# EAGLE design drone_fc (EAGLE 9.5.2)
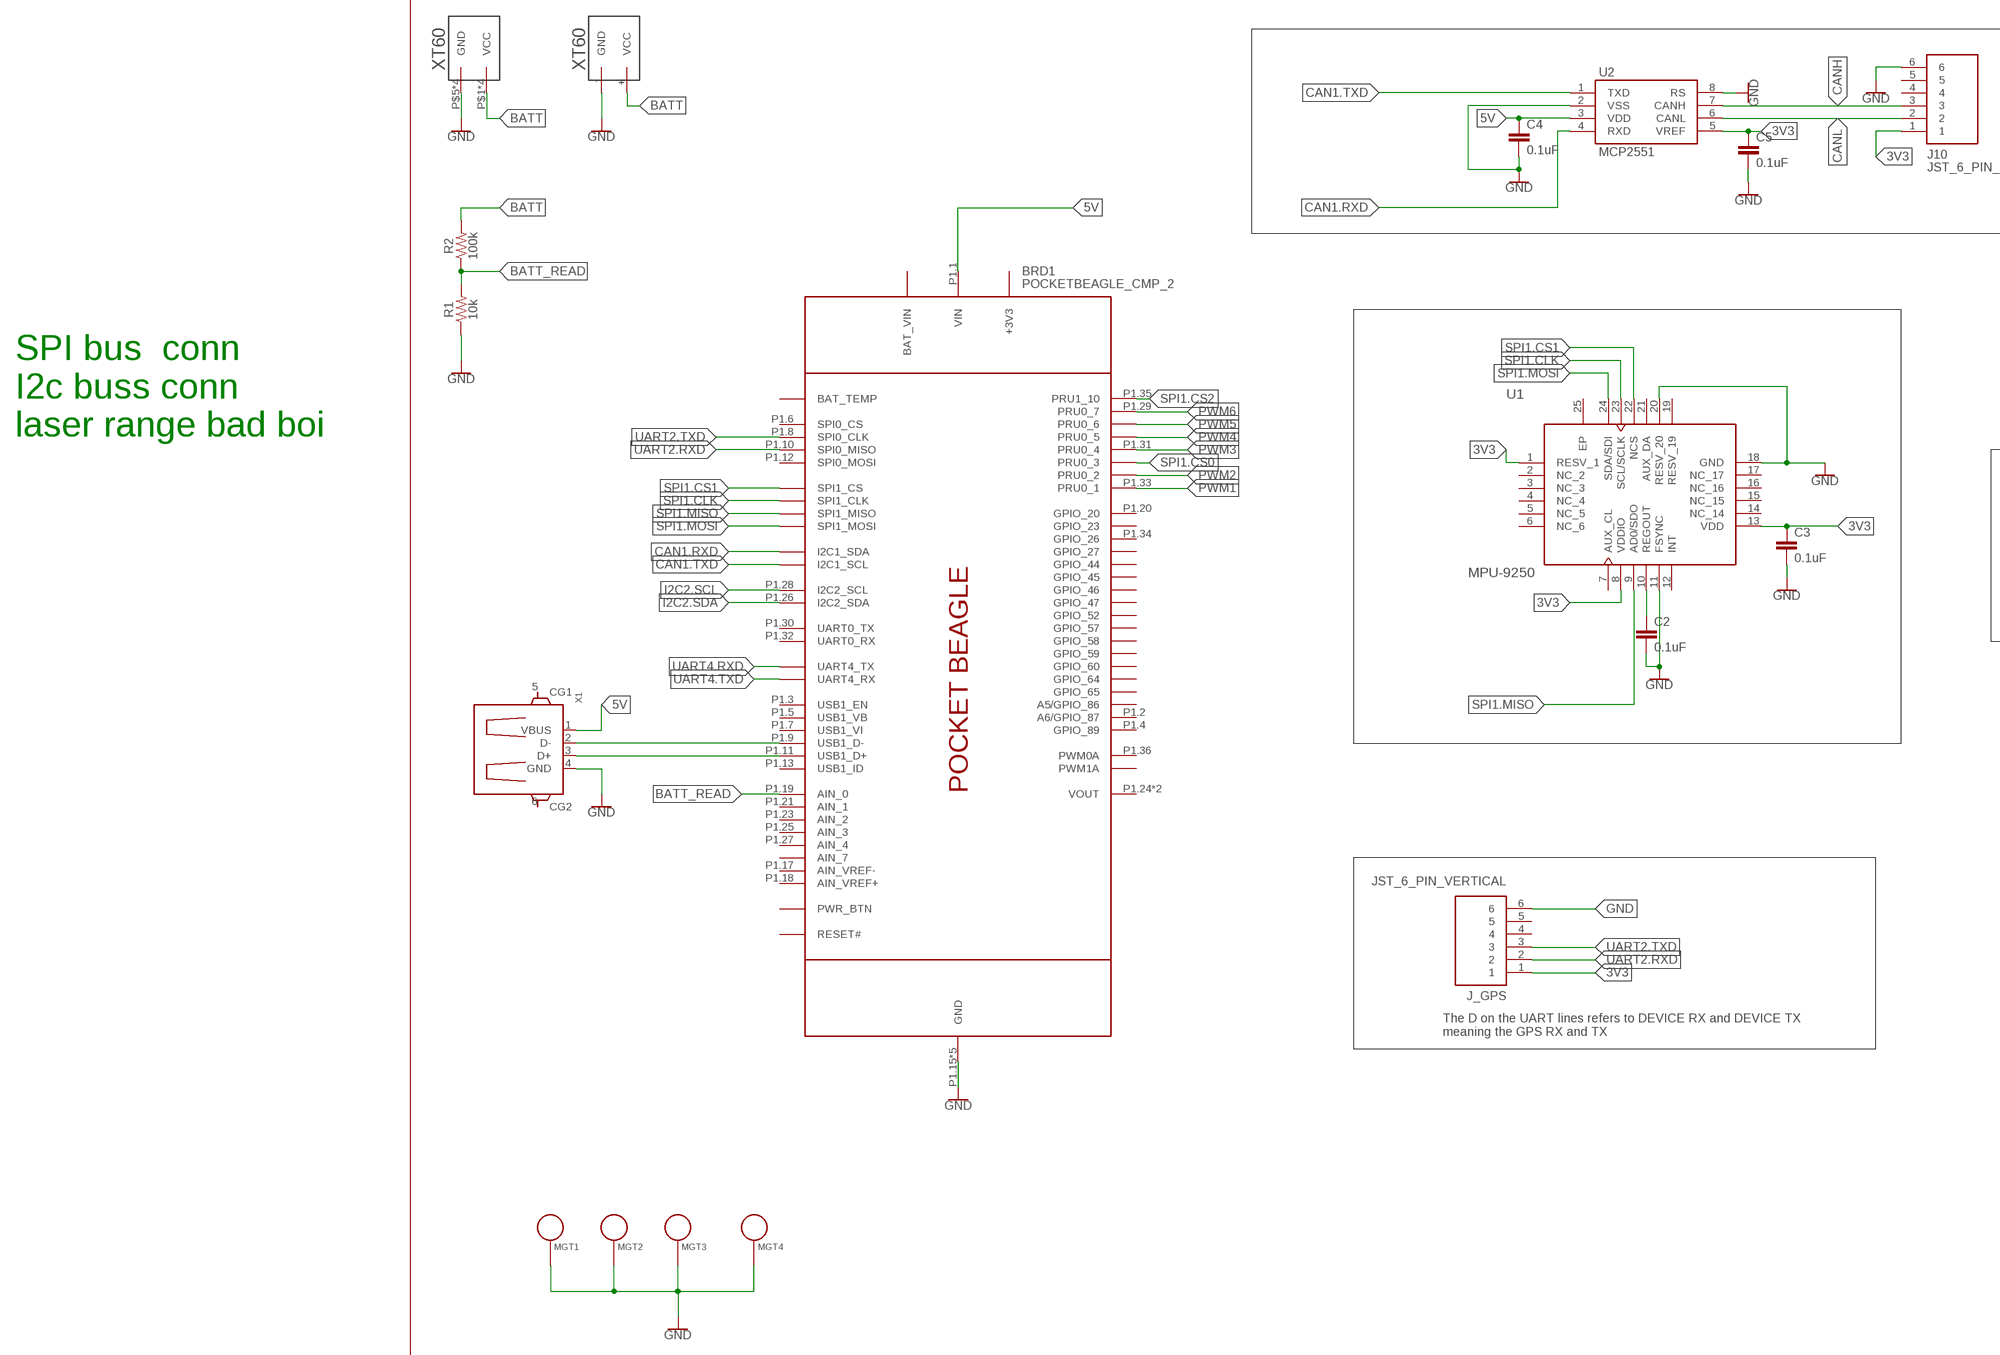
[diagram p0: schematic, sheet 1, part 1 of 2]
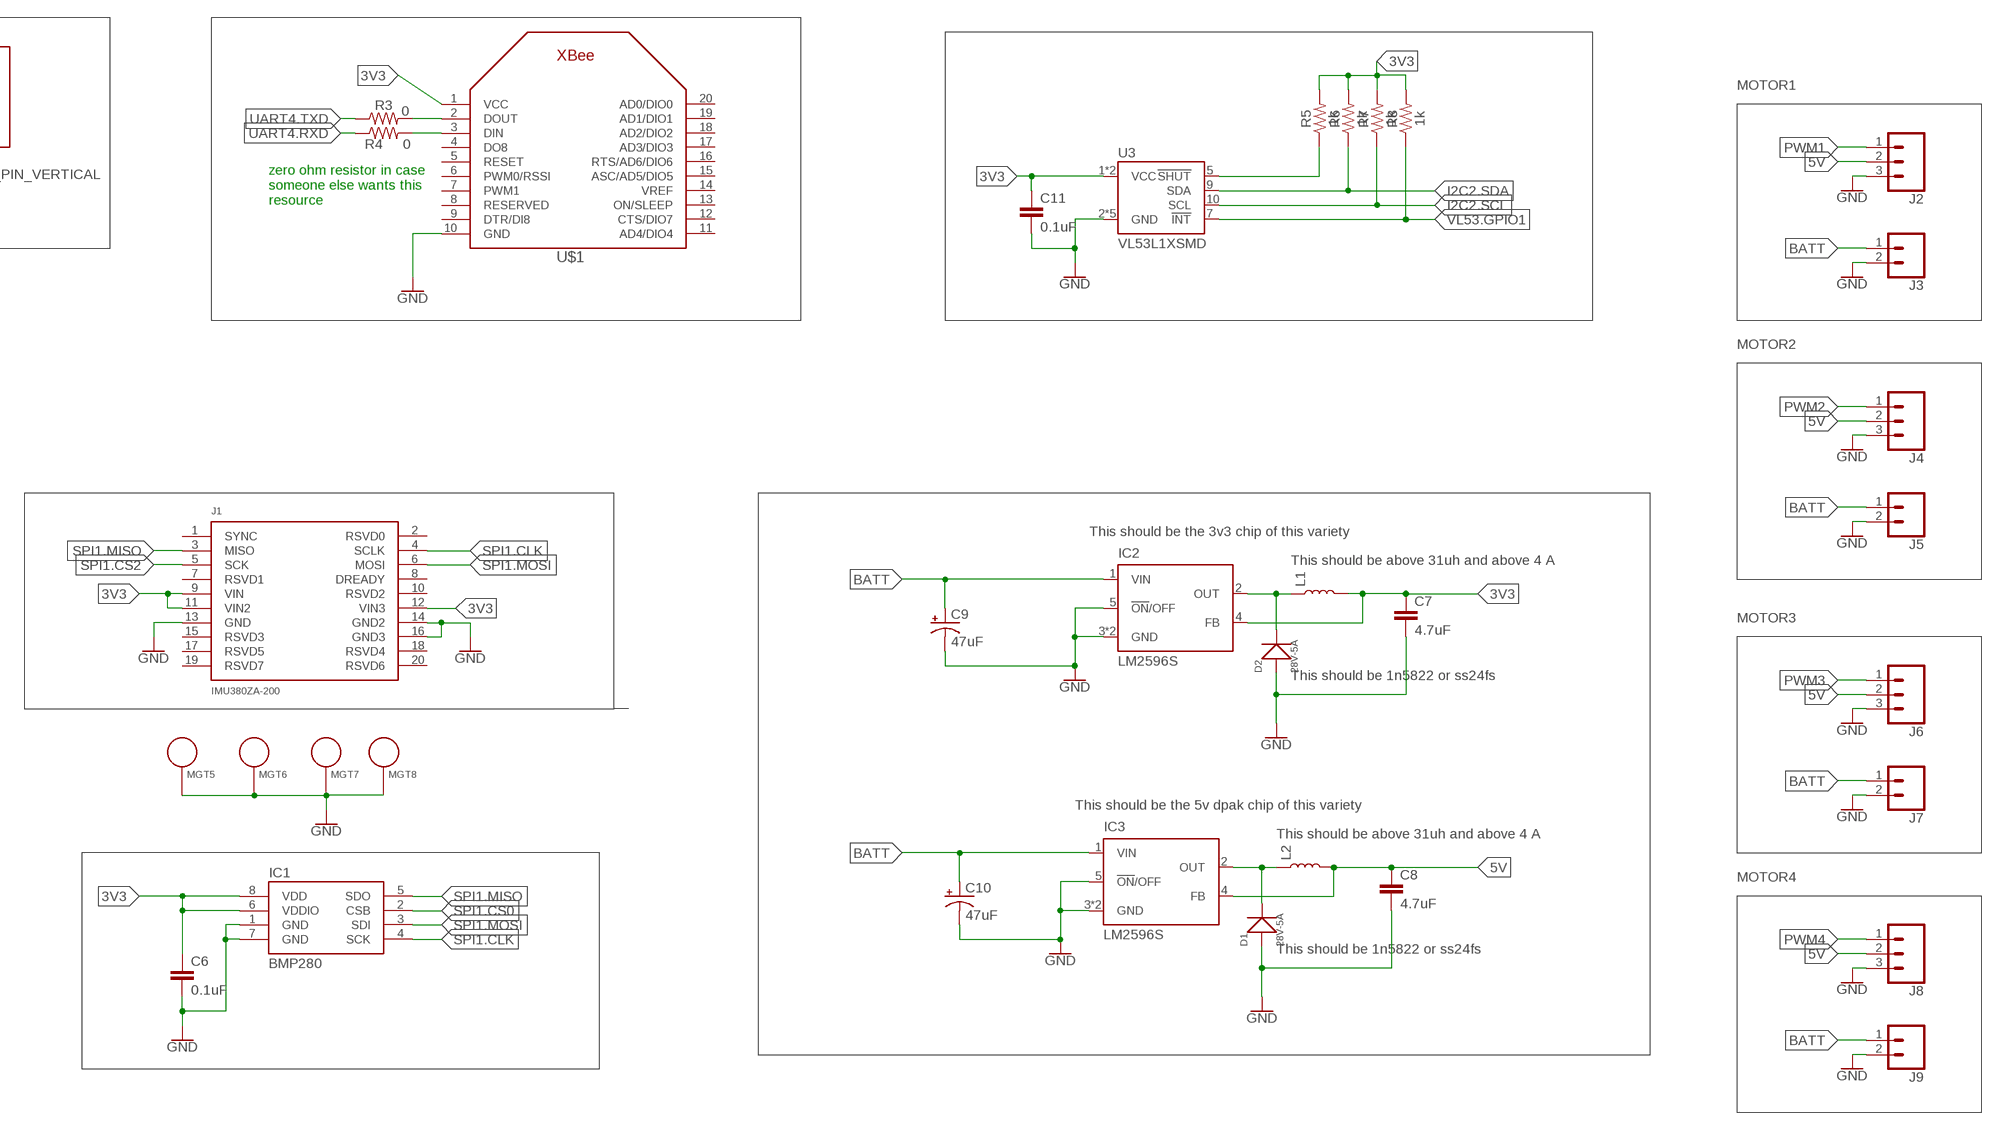
[diagram p1: schematic, sheet 1, part 2 of 2]

## Parts
BRD1  POCKETBEAGLE_CMP_2  [POCKETBEAGLE_CMP]
C2  0.1uF  0.1UF-0603-25V-5%  [0603]
C3  0.1uF  0.1UF-0603-25V-5%  [0603]
C4  0.1uF  0.1UF-0603-25V-5%  [0603]
C5  0.1uF  0.1UF-0603-25V-5%  [0603]
C6  0.1uF  0.1UF-0603-25V-5%  [0603]
C7  4.7uF  4.7UF-1206-16V-(+80/-20%)  [1206]
C8  4.7uF  4.7UF-1206-16V-(+80/-20%)  [1206]
C9  47uF  47UF-POLAR-PANASONIC_D-35V-20%  [PANASONIC_D]
C10  47uF  47UF-POLAR-PANASONIC_D-35V-20%  [PANASONIC_D]
C11  0.1uF  0.1UF-0603-25V-5%  [0603]
D1  28V-5A  SMD-DIODE-SCHOTTKY-28V-5A(DO-214AA)  [DO-214AA]
D2  28V-5A  SMD-DIODE-SCHOTTKY-28V-5A(DO-214AA)  [DO-214AA]
IC1  BMP280  [BMP280]
IC2  LM2596S  [TO263-5]
IC3  LM2596S  [TO263-5]
J1  IMU380ZA-200  [IMU380-CLM-110-02]
J2  CONN_03  [1X03]
J3  CONN_02PTH3  [1X02_LONGPADS]
J4  CONN_03  [1X03]
J5  CONN_02PTH3  [1X02_LONGPADS]
J6  CONN_03  [1X03]
J7  CONN_02PTH3  [1X02_LONGPADS]
J8  CONN_03  [1X03]
J9  CONN_02PTH3  [1X02_LONGPADS]
J10  JST_6_PIN_VERTICAL  [JST-6-SMD-VERT-1.0MM]
J_GPS  JST_6_PIN_VERTICAL  [JST-6-SMD-VERT-1.0MM]
L1  47µH/±30%/750mA  INDUCTOR-CR54-47UH  [CR54]
L2  47µH/±30%/750mA  INDUCTOR-CR54-47UH  [CR54]
MGT1  MOUNTING_HOLE  [BEAGLEBONEBLACK_MOUNTING_HOLE]
MGT2  MOUNTING_HOLE  [BEAGLEBONEBLACK_MOUNTING_HOLE]
MGT3  MOUNTING_HOLE  [BEAGLEBONEBLACK_MOUNTING_HOLE]
MGT4  MOUNTING_HOLE  [BEAGLEBONEBLACK_MOUNTING_HOLE]
MGT5  MOUNTING_HOLE  [BEAGLEBONEBLACK_MOUNTING_HOLE]
MGT6  MOUNTING_HOLE  [BEAGLEBONEBLACK_MOUNTING_HOLE]
MGT7  MOUNTING_HOLE  [BEAGLEBONEBLACK_MOUNTING_HOLE]
MGT8  MOUNTING_HOLE  [BEAGLEBONEBLACK_MOUNTING_HOLE]
R1  10k  10KOHM-0603-1/10W-1%  [0603]
R2  100k  100KOHM-0603-1/10W-1%  [0603]
R3  0  RESISTOR0603  [0603]
R4  0  RESISTOR0603  [0603]
R5  1k  1KOHM-0603-1/10W-1%  [0603]
R6  1k  1KOHM-0603-1/10W-1%  [0603]
R7  1k  1KOHM-0603-1/10W-1%  [0603]
R8  1k  1KOHM-0603-1/10W-1%  [0603]
U1  MPU-9250  [24-QFN]
U2  MCP2551  [SO08]
U3  VL53L1XSMD  [VL53L1X]
U$1  XBEE  [XBEE]
U$2  XT60_RA  [XT60_RA]
U$3  XT60  [XT60]
X1  GHI2_USB_HOST_W/CHASSIS_GND  [GHI2_USB_HOST_HORIZONTAL_W/CHASSIS_GND]

## Nets
3V3: C3.1 C5.1 C6.1 C7.1 C11.1 IC1.6(VDDIO) IC1.8(VDD) IC2.4(FB) J1.9(VIN) J1.11(VIN2) J1.12(VIN3) J10.1 J_GPS.1 L1.P$2 R5.2 R6.2 R7.2 R8.2 U1.1(RESV_1) U1.8(VDDIO) U1.13(VDD) U2.5(VREF) U3.1(VCC) U3.11(VCC) U$1.1(VCC)
5V: BRD1.P1.1(VIN) C4.1 C8.1 IC3.4(FB) J2.2 J4.2 J6.2 J8.2 L2.P$2 U2.3(VDD) X1.1(VBUS)
BATT: C9.+ C10.+ IC2.1(VIN) IC3.1(VIN) J3.1 J5.1 J7.1 J9.1 R2.2 U$2.P$1(VCC) U$2.P$2(VCC) U$2.P$3(VCC) U$2.P$4(VCC) U$3.+(VCC)
BATT_READ: BRD1.P1.19(AIN_0) R1.2 R2.1
CAN1.RXD: BRD1.P2.11(I2C1_SDA) U2.4(RXD)
CAN1.TXD: BRD1.P2.9(I2C1_SCL) U2.1(TXD)
CANH: J10.3 U2.7(CANH)
CANL: J10.2 U2.6(CANL)
GND: BRD1.P1.15(GND) BRD1.P1.16(GND) BRD1.P1.22(GND) BRD1.P2.15(GND) BRD1.P2.21(GND) C2.2 C3.2 C4.2 C5.2 C6.2 C7.2 C8.2 C9.- C10.- C11.2 D1.+ D2.+ IC1.1(GND) IC1.7(GND) IC2.3(GND) IC2.5(!ON!/OFF) IC2.6(GND) IC3.3(GND) IC3.5(!ON!/OFF) IC3.6(GND) J1.13(GND) J1.14(GND2) J1.16(GND3) J2.3 J3.2 J4.3 J5.2 J6.3 J7.2 J8.3 J9.2 J10.6 J_GPS.6 MGT1.P$1 MGT2.P$1 MGT3.P$1 MGT4.P$1 MGT5.P$1 MGT6.P$1 MGT7.P$1 MGT8.P$1 R1.1 U1.11(FSYNC) U1.18(GND) U1.20(RESV_20) U2.2(VSS) U2.8(RS) U3.2(GND) U3.3(GND) U3.4(GND) U3.6(GND) U3.12(GND) U$1.10(GND) U$2.P$5(GND) U$2.P$6(GND) U$2.P$7(GND) U$2.P$8(GND) U$3.-(GND) X1.4(GND)
I2C2.SCL: BRD1.P1.28(I2C2_SCL) R7.1 U3.10(SCL)
I2C2.SDA: BRD1.P1.26(I2C2_SDA) R6.1 U3.9(SDA)
I2C2.SHUT: R5.1 U3.5(!SHUT)
N$2: C2.1 U1.10(REGOUT)
N$3: BRD1.P1.11(USB1_D+) X1.3(D+)
N$4: BRD1.P1.9(USB1_D-) X1.2(D-)
N$6: D2.- IC2.2(OUT) L1.P$1
N$8: D1.- IC3.2(OUT) L2.P$1
N$10: R3.2 U$1.2(DOUT)
N$11: R4.2 U$1.3(DIN)
PWM1: BRD1.P1.33(PRU0_1) J2.1
PWM2: BRD1.P2.32(PRU0_2) J4.1
PWM3: BRD1.P1.31(PRU0_4) J6.1
PWM4: BRD1.P2.34(PRU0_5) J8.1
PWM5: BRD1.P2.28(PRU0_6)
PWM6: BRD1.P1.29(PRU0_7)
SPI1.CLK: BRD1.P2.29(SPI1_CLK) IC1.4(SCK) J1.4(SCLK) U1.23(SCL/SCLK)
SPI1.CS0: BRD1.P2.30(PRU0_3) IC1.2(CSB)
SPI1.CS1: BRD1.P2.31(SPI1_CS) U1.22(NCS)
SPI1.CS2: BRD1.P1.35(PRU1_10) J1.5(SCK)
SPI1.MISO: BRD1.P2.27(SPI1_MISO) IC1.5(SDO) J1.3(MISO) U1.9(AD0/SDO)
SPI1.MOSI: BRD1.P2.25(SPI1_MOSI) IC1.3(SDI) J1.6(MOSI) U1.24(SDA/SDI)
UART2.RXD: BRD1.P1.10(SPI0_MISO) J_GPS.2
UART2.TXD: BRD1.P1.8(SPI0_CLK) J_GPS.3
UART4.RXD: BRD1.P2.7(UART4_TX) R4.1
UART4.TXD: BRD1.P2.5(UART4_RX) R3.1
VL53.GPIO1: R8.1 U3.7(!INT)
Unconnected: BRD1.P1.2(A6/GPIO_87) BRD1.P1.3(USB1_EN) BRD1.P1.4(GPIO_89) BRD1.P1.5(USB1_VB) BRD1.P1.6(SPI0_CS) BRD1.P1.7(USB1_VI) BRD1.P1.12(SPI0_MOSI) BRD1.P1.13(USB1_ID) BRD1.P1.14(+3V3) BRD1.P1.17(AIN_VREF-) BRD1.P1.18(AIN_VREF+) BRD1.P1.20(GPIO_20) BRD1.P1.21(AIN_1) BRD1.P1.23(AIN_2) BRD1.P1.24(VOUT) BRD1.P1.25(AIN_3) BRD1.P1.27(AIN_4) BRD1.P1.30(UART0_TX) BRD1.P1.32(UART0_RX) BRD1.P1.34(GPIO_26) BRD1.P1.36(PWM0A) BRD1.P2.1(PWM1A) BRD1.P2.2(GPIO_59) BRD1.P2.3(GPIO_23) BRD1.P2.4(GPIO_58) BRD1.P2.6(GPIO_57) BRD1.P2.8(GPIO_60) BRD1.P2.10(GPIO_52) BRD1.P2.12(PWR_BTN) BRD1.P2.13(VOUT) BRD1.P2.14(BAT_VIN) BRD1.P2.16(BAT_TEMP) BRD1.P2.17(GPIO_65) BRD1.P2.18(GPIO_47) BRD1.P2.19(GPIO_27) BRD1.P2.20(GPIO_64) BRD1.P2.22(GPIO_46) BRD1.P2.23(+3V3) BRD1.P2.24(GPIO_44) BRD1.P2.26(RESET#) BRD1.P2.33(GPIO_45) BRD1.P2.35(A5/GPIO_86) BRD1.P2.36(AIN_7) J1.1(SYNC) J1.2(RSVD0) J1.7(RSVD1) J1.8(DREADY) J1.10(RSVD2) J1.15(RSVD3) J1.17(RSVD5) J1.18(RSVD4) J1.19(RSVD7) J1.20(RSVD6) J10.4 J10.5 J_GPS.4 J_GPS.5 U1.2(NC_2) U1.3(NC_3) U1.4(NC_4) U1.5(NC_5) U1.6(NC_6) U1.7(AUX_CL) U1.12(INT) U1.14(NC_14) U1.15(NC_15) U1.16(NC_16) U1.17(NC_17) U1.19(RESV_19) U1.21(AUX_DA) U$1.4(DO8) U$1.5(RESET) U$1.6(PWM0/RSSI) U$1.7(PWM1) U$1.8(RESERVED) U$1.9(DTR/DI8) U$1.11(AD4/DIO4) U$1.12(CTS/DIO7) U$1.13(ON/SLEEP) U$1.14(VREF) U$1.15(ASC/AD5/DIO5) U$1.16(RTS/AD6/DIO6) U$1.17(AD3/DIO3) U$1.18(AD2/DIO2) U$1.19(AD1/DIO1) U$1.20(AD0/DIO0) X1.5(CG1) X1.6(CG2)

## Notes on the sheet
- MOTOR1
- zero ohm resistor in case
  someone else wants this
  resource
- MOTOR2
- SPI bus  conn
  I2c buss conn
  laser range bad boi
- This should be the 3v3 chip of this variety
- This should be above 31uh and above 4 A
- MOTOR3
- This should be 1n5822 or ss24fs
- This should be the 5v dpak chip of this variety
- This should be above 31uh and above 4 A
- MOTOR4
- This should be 1n5822 or ss24fs
- The D on the UART lines refers to DEVICE RX and DEVICE TX
  meaning the GPS RX and TX

## Power pins joined to a net without a drawn wire
EP: U1.25(EP)

## Library data of the parts
BRD1 = BeagleBone_pocket:POCKETBEAGLE_?_2: BeagleBoard.org PocketBeagle What is PocketBeagle? PocketBeagle is an ultra-tiny-yet-complete open-source USB-key-fob computer. PocketBeagle features an incredible low cost, slick design and simple usage, making PocketBeagle the ideal development board for beginners and professionals alike. Processor: Octavo Systems OSD3358 1GHz ARMÂ® Cortex-A8 512MB DDR3 RAM integrated Integrated power management 2Ã—32-bit 200-MHz programmable real-time units (PRUs) ARM Cortex-M3 Summary of Key Features Low cost Linux computer with tremendous expansibility Opportunity to learn many programming aspects from educators on-line Openness and flexibility tear-down limits on your imagination Summary of Technical Specifications Based on new Octavo Systems OSD3358-SM 21mm x 21mm system-in-package that includes 512MB DDR3 RAM, 1-GHz ARM Cortex-A8 CPU, 2x 200-MHz PRUs, ARM Cortex-M3, 3D accelerator, power/battery management and EEPROM 72 expansion pin headers with power and battery I/Os, high-speed USB, 8 analog inputs, 44 digital I/Os and numerous digital interface peripherals microUSB host/client and microSD connectors
C2-C6 C11 = SparkFun-Capacitors:0.1UF: 0.1µF ceramic capacitors A capacitor is a passive two-terminal electrical component used to store electrical energy temporarily in an electric field.; PROD_ID: CAP-08604
C7 C8 = SparkFun-Capacitors:4.7UF: 4.7µF ceramic capacitors A capacitor is a passive two-terminal electrical component used to store electrical energy temporarily in an electric field.; PROD_ID: CAP-10300
C9 C10 = SparkFun-Capacitors:47UF-POLAR: 47µF polarized capacitors A capacitor is a passive two-terminal electrical component used to store electrical energy temporarily in an electric field.; PROD_ID: CAP-08478
D1 D2 = Seeed-Diode:SMD-DIODE-SCHOTTKY-28V-5A(DO-214AA): 304020021; MPN: SS54B
IC1 = BeagleBone_Blue_R3:BMP280: BOSCH BMP280 Digital Pressure Sensor
IC2 IC3 = national-semiconductor_DRONEMODS:LM2596: SIMPLE SWITCHER® Power Converter 150 kHz 3A Step-Down Voltage Regulator Source: http://www.national.com/ds/LM/LM2596.pdf; MF: NATIONAL SEMICONDUCTOR; MPN: LM2596S-ADJ/NOPB; OC_FARNELL: 9494367; OC_NEWARK: 41K3842
J1 = mylib:IMU380ZA-200: LOW PROFILE 1MMX1MM DOUBLE ROW BODY. MANUFACTURER:SAMTEC.
J2 J4 J6 J8 = SparkFun-Connectors:CONN_03: Multi connection point. Often used as Generic Header-pin footprint for 0.1 inch spaced/style header connections On any of the 0.1 inch spaced packages, you can populate with these: Break Away Headers - Straight <https://www.sparkfun.com/products/116> (PRT-00116) Break Away Male Headers - Right Angle <https://www.sparkfun.com/products/553> (PRT-00553) Female Headers <https://www.sparkfun.com/products/115> (PRT-00115) Break Away Headers - Machine Pin <https://www.sparkfun.com/products/117> (PRT-00117) Break Away Female Headers - Swiss Machine Pin <https://www.sparkfun.com/products/743> (PRT-00743) Stackable Header - 3 Pin (Female, 0.1") <https://www.sparkfun.com/products/13875> (PRT-13875) For SCREWTERMINALS and SPRING TERMINALS visit here: Screw Terimnals on SparkFun.com <https://www.sparkfun.com/search/results?term=Screw+Terminals> (5mm/3.5mm/2.54mm spacing) This device is also useful as a general connection point to wire up your design to another part of your project. Our various solder wires solder well into these plated through hole pads. Hook-Up Wire - Assortment (Stranded, 22 AWG) <https://www.sparkfun.com/products/11375> (PRT-11375) Hook-Up Wire - Assortment (Solid Core, 22 AWG) <https://www.sparkfun.com/products/11367> (PRT-11367) View the entire wire category on our website here <https://www.sparkfun.com/categories/141> Special notes: Molex polarized connector foot print use with SKU : PRT-08232 with associated crimp pins and housings.
J3 J5 J7 J9 = SparkFun-Connectors:CONN_02: Multi connection point. Often used as Generic Header-pin footprint for 0.1 inch spaced/style header connections On any of the 0.1 inch spaced packages, you can populate with these: Break Away Headers - Straight <https://www.sparkfun.com/products/116> (PRT-00116) Break Away Male Headers - Right Angle <https://www.sparkfun.com/products/553> (PRT-00553) Female Headers <https://www.sparkfun.com/products/115> (PRT-00115) Break Away Headers - Machine Pin <https://www.sparkfun.com/products/117> (PRT-00117) Break Away Female Headers - Swiss Machine Pin <https://www.sparkfun.com/products/743> (PRT-00743) For SCREWTERMINALS and SPRING TERMINALS visit here: Screw Terimnals on SparkFun.com <https://www.sparkfun.com/search/results?term=Screw+Terminals> (5mm/3.5mm/2.54mm spacing) This device is also useful as a general connection point to wire up your design to another part of your project. Our various solder wires solder well into these plated through hole pads. Hook-Up Wire - Assortment (Stranded, 22 AWG) <https://www.sparkfun.com/products/11375> (PRT-11375) Hook-Up Wire - Assortment (Solid Core, 22 AWG) <https://www.sparkfun.com/products/11367> (PRT-11367) View the entire wire category on our website here <https://www.sparkfun.com/categories/141> Special notes: Molex polarized connector foot print use with: PRT-08233 with associated crimp pins and housings. 2.54_SCREWTERM for use with PRT-10571. 3.5mm Screw Terminal footprints for PRT-08084 5mm Screw Terminal footprints for use with PRT-08432
J10 J_GPS = SparkFun-Connectors:JST_6_PIN_VERTICAL: JST 6 pin vertical connector Here is a six pin vertical 1.0mm pitch connector. It is useful if you need something very tiny as a connection. These are not the standard JST type connectors we use on most of our boards, but are actually the much smaller JST-SH type. Here is the connector we sell at SparkFun: JST SH Vertical 6-Pin Connector - SMD <https://www.sparkfun.com/products/579> (GPS-00579) Datasheet <http://www.sparkfun.com/datasheets/GPS/EM406-SMDConnector-eSH.pdf> It was used on these SparkFun products: SparkFun GPS Breakout <https://www.sparkfun.com/products/11818> (BOB-11818) SparkFun Weather Shield <https://www.sparkfun.com/products/12081> (DEV-12081) And many, many other GPS related products.; PROD_ID: CONN-08249; SF_ID: GPS-00579
L1 L2 = SparkFun-Coils:INDUCTOR: Inductors Resist changes in electrical current. Basically a coil of wire. SparkFun Products: SparkFun Load Cell Amplifier - HX711 <https://www.sparkfun.com/products/13879> IOIO-OTG - V2.2 <https://www.sparkfun.com/products/13613>; PROD_ID: NDUC-10789
MGT1-MGT8 = BeagleBone_Blue_R3:MOUNTING_HOLE: Chassis Mounting Hole w/GND connection ability
R1 = SparkFun-Resistors:10KOHM: 10kΩ resistor A resistor is a passive two-terminal electrical component that implements electrical resistance as a circuit element. Resistors act to reduce current flow, and, at the same time, act to lower voltage levels within circuits. - Wikipedia; PROD_ID: RES-00824
R2 = SparkFun-Resistors:100KOHM: 100kΩ resistor A resistor is a passive two-terminal electrical component that implements electrical resistance as a circuit element. Resistors act to reduce current flow, and, at the same time, act to lower voltage levels within circuits. - Wikipedia; PROD_ID: RES-07828
R3 R4 = SparkFun-Resistors:RESISTOR: Generic Resistor Package
R5-R8 = SparkFun-Resistors:1KOHM: 1kΩ resistor A resistor is a passive two-terminal electrical component that implements electrical resistance as a circuit element. Resistors act to reduce current flow, and, at the same time, act to lower voltage levels within circuits. - Wikipedia; PROD_ID: RES-07856
U1 = Sensor:MPU-9250: IMU ACCEL/GYRO/MAG I2C/SPI 24QFN Manufacturer's datasheet <https://media.digikey.com/pdf/Data%20Sheets/TDK%20PDFs/MPU-9250_Rev_1.1.pdf>; CREATED_BY: PCBLayout.com; DIGIKEY_PART_NUMBER: 1428-1019-1-ND; MANUFACTURER: TDK InvenSense; MPN: MPU-9250; PACKAGE: QFN-24
U2 = SparkFun-IC-Comms:MCP2551: MCP2551 High Speed CAN Transceiver High speed CAN transceiver Datasheet <http://www.sparkfun.com/datasheets/DevTools/Arduino/MCP2551.pdf> SparkFun Products CAN-BUS Shield <https://www.sparkfun.com/products/13262> (DEV-13262) SparkFun OBD-II UART <https://www.sparkfun.com/products/9555> (WIG-09555); PROD_ID: IC-09907
U3 = SparkFun-Sensors:VL53L1X: STMicroelectronics VL53L1X - 400 cm IR Laser ToF Sensor VL53L1X is a state-of-the-art ToF laser-ranging sensor, enhancing the ST FlightSense product family. It is the fastest miniature ToF sensor currently on the market with accurate ranging up to 4 m and fast ranging frequency (up to 50 Hz). Housed in a miniature and reflowable package, it integrates a single photon avalanche diode (SPAD) receiving array, a 940 nm invisible laser Class 1 emitter, physical infrared filters, and optics to achieve the best ranging performance in various ambient lighting conditions with a range of cover window options.; PROD_ID: IC-13960
U$1 = adafruit:XBEE
U$2 = XT60:XT60_RA: XT60
U$3 = XT60:XT60: XT60
X1 = BeagleBone_Black_Wireless:GHI2_USB_HOST_W/CHASSIS_GND

## Module TEST
Ports: 

### Library data of the parts

## Board
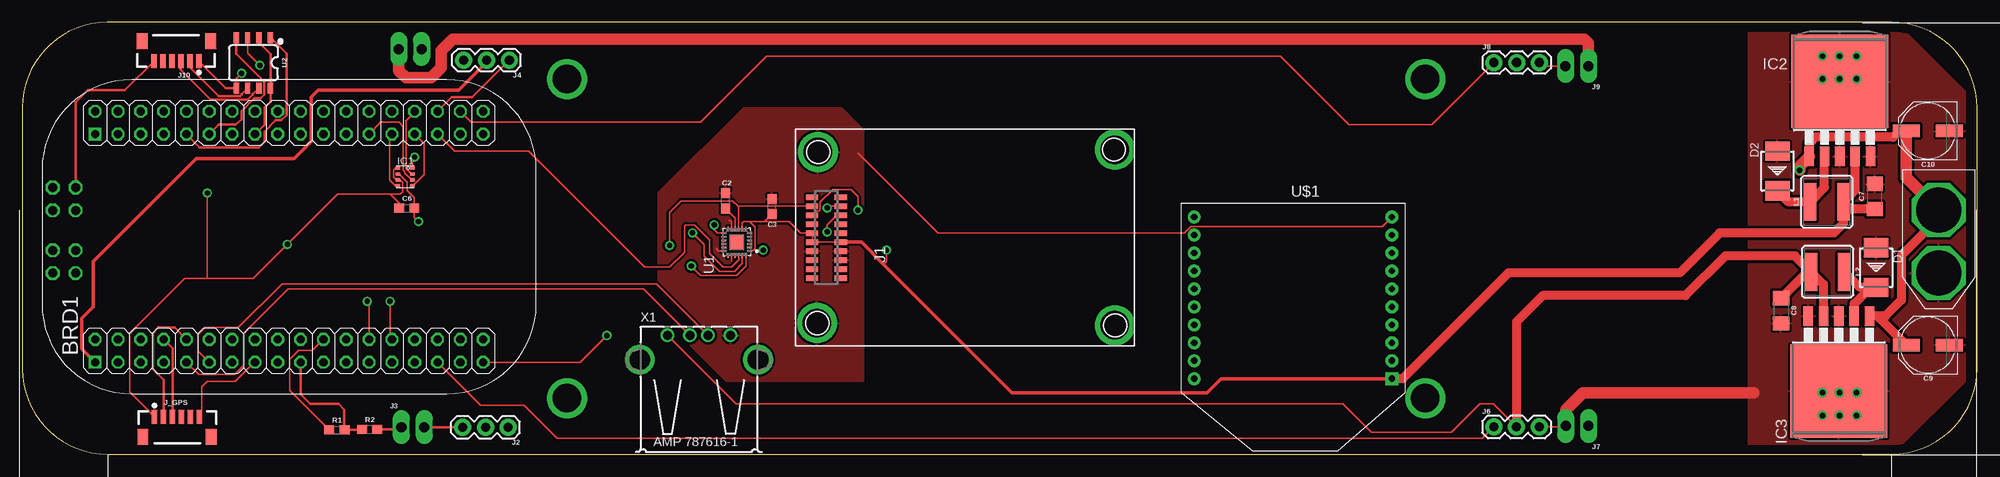
[diagram p2: board, top side]
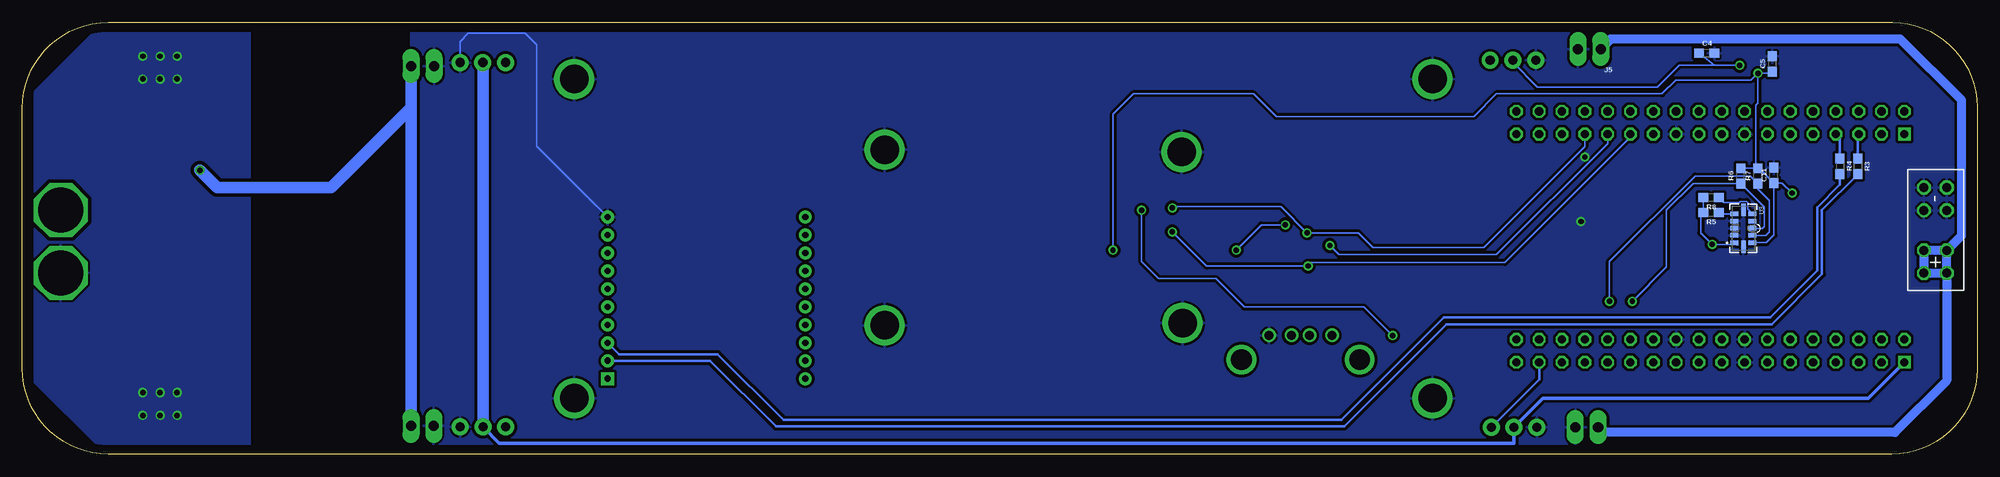
[diagram p3: board, bottom side, seen from below]

Size 217.49 x 48.07 mm. Coordinates in mm from the lower left corner, seen from the top.
Outline: 9.47,0 207.94,0 arc90 217.49,9.54 217.49,38.54 arc90 207.95,48.07 9.42,48.07 arc90 0,38.65 0,9.47 arc90 9.47,0
Copper layers (1*16): Top 0.035mm / dielectric 1.5mm / Bottom 0.035mm
Design rules "default": minimum track width 6mil, minimum drill 0.35mm, track to track 6mil, track to pad 6mil, pad to pad 6mil, via to via 6mil, smd to smd 6mil, copper to edge 40mil, drill to drill 6mil, minimum pad ring 10mil, minimum via ring 8mil, stop-mask expansion 4mil, vias tented up to drill 0mil, thermal gap 10mil

### Footprints (pad centres in the part's own frame; a part is rotated, then mirrored left to right if it is on the bottom)
POCKETBEAGLE_CMP = drill 0.9 square: P1.1 -21.59,-13.97; P2.1 -21.59,11.43 | drill 0.9 octagon: P1.2 -21.59,-11.43; P1.3 -19.05,-13.97; P1.4 -19.05,-11.43; P1.5 -16.51,-13.97; P1.6 -16.51,-11.43; P1.7 -13.97,-13.97; P1.8 -13.97,-11.43; P1.9 -11.43,-13.97; P1.10 -11.43,-11.43; P1.11 -8.89,-13.97; P1.12 -8.89,-11.43; P1.13 -6.35,-13.97; P1.14 -6.35,-11.43; P1.15 -3.81,-13.97; P1.16 -3.81,-11.43; P1.17 -1.27,-13.97; P1.18 -1.27,-11.43; P1.19 1.27,-13.97; P1.20 1.27,-11.43; P1.21 3.81,-13.97; P1.22 3.81,-11.43; P1.23 6.35,-13.97; P1.24 6.35,-11.43; P1.25 8.89,-13.97; P1.26 8.89,-11.43; P1.27 11.43,-13.97; P1.28 11.43,-11.43; P1.29 13.97,-13.97; P1.30 13.97,-11.43; P1.31 16.51,-13.97; P1.32 16.51,-11.43; P1.33 19.05,-13.97; P1.34 19.05,-11.43; P1.35 21.59,-13.97; P1.36 21.59,-11.43; P2.2 -21.59,13.97; P2.3 -19.05,11.43; P2.4 -19.05,13.97; P2.5 -16.51,11.43; P2.6 -16.51,13.97; P2.7 -13.97,11.43; P2.8 -13.97,13.97; P2.9 -11.43,11.43; P2.10 -11.43,13.97; P2.11 -8.89,11.43; P2.12 -8.89,13.97; P2.13 -6.35,11.43; P2.14 -6.35,13.97; P2.15 -3.81,11.43; P2.16 -3.81,13.97; P2.17 -1.27,11.43; P2.18 -1.27,13.97; P2.19 1.27,11.43; P2.20 1.27,13.97; P2.21 3.81,11.43; P2.22 3.81,13.97; P2.23 6.35,11.43; P2.24 6.35,13.97; P2.25 8.89,11.43; P2.26 8.89,13.97; P2.27 11.43,11.43; P2.28 11.43,13.97; P2.29 13.97,11.43; P2.30 13.97,13.97; P2.31 16.51,11.43; P2.32 16.51,13.97; P2.33 19.05,11.43; P2.34 19.05,13.97; P2.35 21.59,11.43; P2.36 21.59,13.97
0603 = smd 1.1 x 1: 1 -0.85,0; 2 0.85,0
1206 = smd 1.6 x 1.8: 1 -1.4,0; 2 1.4,0
PANASONIC_D = smd 3 x 1.4: + 2.4,0; - -2.4,0
DO-214AA = smd 2.159 x 2.743: + -2.21,0; - 2.21,0
BMP280 = smd 0.5 x 0.35: 1 0.8,0.975; 2 0.8,0.325; 3 0.8,-0.325; 4 0.8,-0.975; 5 -0.8,-0.975; 6 -0.8,-0.325; 7 -0.8,0.325; 8 -0.8,0.975
TO263-5 = smd 1.067 x 2.159: 1 -3.404,-5.791; 2 -1.702,-5.791; 3 0,-5.791; 4 1.702,-5.791; 5 3.404,-5.791 | smd 10.8 x 10.41: 6 0,2.54
IMU380-CLM-110-02 = smd 0.61 x 1.372: 1 4.503,1.6; 2 4.503,-1.6; 3 3.503,1.6; 4 3.503,-1.6; 5 2.502,1.6; 6 2.502,-1.6; 7 1.501,1.6; 8 1.501,-1.6; 9 0.5,1.6; 10 0.5,-1.6; 11 -0.5,1.6; 12 -0.5,-1.6; 13 -1.501,1.6; 14 -1.501,-1.6; 15 -2.502,1.6; 16 -2.502,-1.6; 17 -3.503,1.6; 18 -3.503,-1.6; 19 -4.503,1.6; 20 -4.503,-1.6
1X03 = drill 1.016 pad 1.88: 1 0,0; 2 2.54,0; 3 5.08,0
1X02_LONGPADS = drill 1.118 pad 1.88 long: 1 0,0; 2 2.54,0
JST-6-SMD-VERT-1.0MM = smd 0.6 x 1.55: 1 -2.54,1.27; 2 -1.54,1.27; 3 -0.54,1.27; 4 0.46,1.27; 5 1.46,1.27; 6 2.46,1.27 | smd 1.2 x 1.8: P$1 -3.84,-0.955; P$2 3.76,-0.955
CR54 = smd 4.2 x 1.4: P$1 0,1.85; P$2 0,-1.85
BEAGLEBONEBLACK_MOUNTING_HOLE = drill 3.175 pad 4.445: P$1 0,0
24-QFN = smd 0.22 x 0.58: 1 -1,-1.475; 2 -0.6,-1.475; 3 -0.2,-1.475; 4 0.2,-1.475; 5 0.6,-1.475; 6 1,-1.475; 13 1,1.475; 14 0.6,1.475; 15 0.2,1.475; 16 -0.2,1.475; 17 -0.6,1.475; 18 -1,1.475 | smd 0.58 x 0.22: 7 1.475,-1; 8 1.475,-0.6; 9 1.475,-0.2; 10 1.475,0.2; 11 1.475,0.6; 12 1.475,1; 19 -1.475,1; 20 -1.475,0.6; 21 -1.475,0.2; 22 -1.475,-0.2; 23 -1.475,-0.6; 24 -1.475,-1 | smd 1.7 x 1.54: 25 0,0
SO08 = smd 0.6 x 1.2: 1 -1.905,-2.8; 2 -0.635,-2.8; 3 0.635,-2.8; 4 1.905,-2.8; 5 1.905,2.8; 6 0.635,2.8; 7 -0.635,2.8; 8 -1.905,2.8
VL53L1X = smd 0.5 x 0.9: 1 1.6,-1; 2 0.8,-1; 3 0,-1; 4 -0.8,-1; 5 -1.6,-1; 7 -1.6,1; 8 -0.8,1; 9 0,1; 10 0.8,1; 11 1.6,1 | smd 1.4 x 0.5: 6 -2.05,0; 12 2.05,0
XBEE = drill 0.7 pad 1.422 square: 1 -11,5.5 | drill 0.7 pad 1.422: 2 -11,3.5; 3 -11,1.5; 4 -11,-0.5; 5 -11,-2.5; 6 -11,-4.5; 7 -11,-6.5; 8 -11,-8.5; 9 -11,-10.5; 10 -11,-12.5; 11 11,-12.5; 12 11,-10.5; 13 11,-8.5; 14 11,-6.5; 15 11,-4.5; 16 11,-2.5; 17 11,-0.5; 18 11,1.5; 19 11,3.5; 20 11,5.5
XT60_RA = drill 1 octagon: P$1 1.905,1.27; P$2 4.445,1.27; P$3 1.905,-1.27; P$4 4.445,-1.27; P$5 8.89,1.27; P$6 11.43,1.27; P$7 8.89,-1.27; P$8 11.43,-1.27
XT60 = drill 5 octagon: + 4.5,0; - 11.5,0
GHI2_USB_HOST_HORIZONTAL_W/CHASSIS_GND = drill 1: 1 -3.5,12.99; 2 -1,12.99; 3 1,12.99; 4 3.5,12.99 | drill 2.3: 5 -6.57,10.28; 6 6.57,10.28

### Placement (x,y rotation side)
BRD1  29.67,24.2 0 top
C2  78.24,28.21 90 top
C3  83.39,27.58 90 top
C4  30.08,44.66 0 bottom
C5  22.76,43.45 90 bottom
C6  42.76,27.39 0 top
C7  206.11,28.69 90 top
C8  195.68,15.95 270 top
C9  212.02,12.16 180 top
C10  212,35.98 180 top
C11  22.61,31.05 90 bottom
D1  206.26,20.78 270 top
D2  195.27,31.53 270 top
IC1  42.6,30.88 0 top
IC2  202.21,38.95 0 top
IC3  202.11,9.57 180 top
J1  89.45,24.12 90 top
J2  54.06,2.99 180 top
J3  42.16,3.01 0 top
J4  54.18,43.88 180 top
J5  41.86,45.12 180 bottom
J6  163.71,3.03 0 top
J7  174.26,3.14 180 top
J8  163.72,43.61 0 top
J9  174.24,43.22 180 top
J10  17.09,45.02 180 top
J_GPS  17.24,2.88 0 top
L1  200.77,28.1 90 top
L2  200.87,20.29 270 top
MGT1  60.58,6.22 90 top
MGT2  60.58,41.78 90 top
MGT3  156.09,41.78 90 top
MGT4  156.09,6.22 90 top
MGT5  88.52,33.65 0 top
MGT6  121.54,33.9 0 top
MGT7  121.54,14.35 0 top
MGT8  88.39,14.6 0 top
R1  34.98,2.69 0 top
R2  38.63,2.75 0 top
R3  13.27,32.05 270 bottom
R4  15.25,32.05 270 bottom
R5  29.59,26.92 180 bottom
R6  26.29,30.98 90 bottom
R7  24.39,30.98 90 bottom
R8  29.59,28.57 180 bottom
U1  79.49,23.61 90 top
U2  25.7,43.57 180 top
U3  26,25.15 270 bottom
U$1  141.38,13.9 180 top
U$2  4.64,18.25 90 bottom
U$3  213.22,31.67 270 top
X1  75.27,0.25 0 top

### Tracks (layer width: path | path; a pad name or v marks a point on that pad's centre or on a via)
3V3  (via drill 0.6)
  Top 0.152: U2.5 23.79,41.82 v24.39,42.41 | 87.89,23.62 J1.12 | 87.89,23.62 J1.11 | 87.89,23.62 87.89,24.59 J1.9 86.58,24.62 85.31,25.89 80.91,25.89 | IC1.8 41.51,31.85 41.28,31.62 41.28,30.86 41.58,30.55 IC1.6 41.96,30.55 42.29,30.22 42.29,29.2 42.04,28.95 40.9,28.95 | 40.9,28.95 35.05,28.95 v29.47,23.36 25.66,19.55 20.58,19.55 | J_GPS.1 11.94,6.91 11.94,13.46 18.04,19.55 20.58,19.55 | C6.1 41.91,27.94 40.9,28.95 | 80.91,25.89 81.54,25.27 81.54,22.89 81.37,22.73 | 80.91,25.89 80.9,25.9 | 80.9,25.9 80.27,25.9 80.09,25.73 U1.8 | C3.1 82.57,25.9 80.9,25.9 | v96.14,22.73 96.14,21.46 95.82,21.14 | U1.1 81.03,22.67 81.32,22.67 81.37,22.73 | 81.37,22.73 v82.42,22.73 | v76.96,25.52 76.96,25.01 77.37,24.61 U1.13 | 20.58,19.55 v20.58,29.08
  Top 0.254: U2.5 22.62,40.77 J10.1
  Top 0.406: U$1.1 133.33,8.4 131.79,6.85 110.11,6.85 95.82,21.14 93.34,23.62 J1.12
  Top 1.016: L1.P$2 203.91,29.39 IC2.4 | C7.1 203.43,27.29 L1.P$2 | L1.P$2 202.62,25.7 201.55,24.63 188.85,24.63 184.41,20.19 165.36,20.19 153.57,8.4 U$1.1
  Bottom 0.152: v24.39,42.41 24.39,39.11 24.64,38.86 24.64,32.09 R7.2 | v24.39,42.41 22.95,42.41 C5.1 | v24.39,42.41 25.15,41.65 33.53,41.65 35.05,40.13 53.47,40.13 56.01,37.59 77.98,37.59 80.52,40.13 93.85,40.13 96.14,37.84 v96.14,22.73 | 24.91,23.47 25.02,23.36 25.02,23.53 U3.11 23.44,23.55 22.61,24.38 C11.1 | U3.1 27.03,23.52 27.03,23.55 27.22,23.36 v29.47,23.36 30.74,24.63 30.74,26.62 R5.2 R8.2 | v82.42,22.73 79.63,25.52 v76.96,25.52 | R6.2 R7.2 | C11.1 24.24,31.83 R7.2 | v20.58,29.08 21.7,30.2 C11.1
  Bottom 0.254: 24.91,23.47 U3.11
5V  (via drill 0.6)
  Top 0.152: U2.3 25.06,44.66 v26.42,43.3 | X1.1 78.58,6.43 78.79,6.22 79.43,5.58 146.94,5.58 150.12,2.41 159.01,2.41 162.18,5.58 163.7,5.58 J6.2
  Top 0.406: BRD1.P1.1 6.61,11.71 6.61,15.11 7.88,16.38 7.88,21.46 19.31,32.89 30.23,32.89 32.13,34.79 32.13,39.75 32.9,40.51 48.52,40.51 51.64,43.63 J4.2
  Top 1.016: L2.P$2 200.41,18.91 IC3.4 | L2.P$2 197.22,22.09 189.49,22.09 185.04,17.65 169.17,17.65 166.25,14.73 J6.2 | C8.1 198.62,20.29 L2.P$2
  Bottom 0.152: C4.1 29.24,43.3 v26.42,43.3 33.15,43.3 35.56,40.89 48.9,40.89 51.64,43.63 J4.2
  Bottom 0.406: BRD1.P1.1 12.1,6.22 48.29,6.22 J2.2 51.52,1.23 164.45,1.23 J6.2
  Bottom 1.016: 166.25,43.6 J8.2
  Bottom 1.27: J6.2 166.25,43.6
BATT  (via drill 0.6)
  Top 0.254: J3.1 41.91,2.75 R2.2
  Top 1.016: U$3.+ 213.22,26.28 209.07,22.12 209.07,17.14 207.29,15.37 IC3.1 206.41,15.37 C9.+ | C10.+ 208.84,35.98 208.16,35.3 199.52,35.3 198.81,34.59 IC2.1
  Top 1.27: U$3.+ 209.6,30.79 C10.+ | IC2.1 197.74,32.09 v197.74,31.62 | J5.1 41.86,42.71 42.67,41.9 45.47,41.9 46.61,43.05 46.61,44.95 47.88,46.22 173.78,46.22 174.24,45.76 J9.1
  Bottom 1.016: U$2.P$3 3.37,8.18 9.15,2.41 41.56,2.41 J3.1 | U$2.P$4 U$2.P$2 U$2.P$1 U$2.P$3 | U$2.P$3 U$2.P$4 | U$2.P$4 1.73,24.34 1.73,39.39 8.55,46.22 40.76,46.22 J5.1
  Bottom 1.27: v197.74,31.62 195.84,29.71 183.14,29.71 174.24,38.6 J9.1 174.26,43.2 J7.1
BATT_READ
  Top 0.254: R2.1 37.72,2.69 R1.2 35.82,2.71 35.82,4.95 35.18,5.58 32.01,5.58 30.94,6.64 BRD1.P1.19
CAN1.RXD
  Top 0.254: U2.4 23.79,44.6 26.91,41.48 26.91,40.05 26.49,39.64 25.81,39.64 24.39,38.21 24.39,37.33 23.75,36.7 21.85,36.7 BRD1.P2.11
CAN1.TXD
  Top 0.254: U2.1 29.39,44.58 29.39,37.77 28.81,37.19 28.18,37.19 26.93,35.94 26.93,34.79 26.29,34.16 19.72,34.16 BRD1.P2.9
CANH
  Top 0.254: U2.7 25.64,40.08 25.64,40.05 25.07,39.48 20.97,39.48 17.63,42.81 J10.3
CANL
  Top 0.254: U2.6 24.37,40.08 24.37,40.05 24.21,39.89 21.83,39.89 18.63,43.08 J10.2
GND  (via drill 0.6)
  Top 0.152: J_GPS.6 19.94,4.39 19.94,7.49 20.58,8.12 23.67,8.12 25.78,10.23 BRD1.P1.15 | IC1.7 41.9,31.2 42.79,30.31 42.79,29.38 43.61,28.57 C6.2 43.61,26.37 v44.07,25.9 | R1.1 29.72,7.11 29.72,10.53 30.74,11.55 32.26,11.55 BRD1.P1.22 | IC1.1 43.4,32.85 v43.63,33.08 | U$1.10 151.32,25.34 130,25.34 129.29,24.63 101.86,24.63 92.97,33.52 | U1.20 78.89,21.56 | U1.18 78.01,22.6 77.47,22.6 77.22,22.85 77.22,22.98 | U1.11 78.89,25.88 78.74,26.03 78.61,26.03 | J7.2 171.61,3.03 J6.3 | J9.2 169.2,43.22 J8.3
  Top 0.254: U2.2 26.33,45.81 27.6,44.54 U2.8 27.6,39.28 26.93,38.6 26.93,36.7 BRD1.P2.15 | J10.6 11.39,40.51 7.24,40.51 5.91,39.18 U$2.P$6 | J2.3 J3.2
  Top 1.27: 192.66,6.85 173.61,6.85 171.72,4.96 J7.2
  Bottom 0.152: U$1.10 160.28,34.29 160.28,45.59 161.55,46.86 167.9,46.86 168.8,45.95 J8.3
  other vias: 202.19,41.78 200.28,41.78 200.28,44.32 202.19,44.32 204.09,44.32 204.09,41.78 202.19,6.85 204.09,6.85 200.28,6.85 200.28,4.31 202.19,4.31 204.09,4.31
  pour Bottom (isolate 0.406): 192.15,0.76 208.92,0.76 216.16,7.99 216.16,40.38 209.3,47.24 192.15,47.24
  pour Top (isolate 0.305): 192.03,0.63 208.66,0.63 216.16,8.12 216.16,40.38 209.3,47.24 192.03,47.24
  pour Bottom (isolate 0.305): 2.16,9.39 10.42,1.14 174.25,1.14 174.25,47.49 9.15,47.49 2.16,40.51
  pour Top (isolate 0.254): 93.6,8.12 93.6,36.06 91.06,38.6 80.27,38.6 70.74,29.08 70.74,15.74 78.36,8.12
I2C2.SCL  (via drill 0.6)
  Top 0.152: BRD1.P1.28 40.9,12.98 v40.9,17.01
  Bottom 0.152: U3.10 23.5,24.35 23.12,24.74 23.12,28.23 24.39,29.5 R7.1 25.24,30.98 31.37,30.98 40.9,21.46 v40.9,17.01
I2C2.SDA  (via drill 0.6)
  Top 0.152: BRD1.P1.26 38.56,16.8 v38.36,17.01
  Bottom 0.152: U3.9 23.87,25.15 23.68,25.34 23.68,27.52 R6.1 31.59,30.13 34.55,27.17 34.55,20.82 v38.36,17.01
I2C2.SHUT
  Bottom 0.152: U3.5 28.58,26.75 R5.1
N$2
  Top 0.152: U1.10 79.29,25.77 79.3,25.78 79.3,26.3 C2.1
N$3
  Top 0.152: X1.3 70.54,18.97 28.88,18.97 24.01,14.09 20.32,14.09 19.56,13.33 19.56,11.46 BRD1.P1.11
N$4
  Top 0.152: X1.2 69.1,18.41 29.59,18.41 24.64,13.46 24.64,9.9 23.62,8.88 19.59,8.88 BRD1.P1.9
N$6
  Top 1.016: IC2.2 200.51,29.69 L1.P$1 196.5,28.1 D2.-
N$8
  Top 1.016: L2.P$1 204.45,18.56 D1.- 205.64,18.56 203.81,16.73 IC3.2
N$10
  Bottom 0.254: R3.2 13.27,31.15 17.26,27.17 17.26,20.04 22.83,14.47 59.02,14.47 70.4,3.09 133.66,3.09 140.96,10.4 U$1.2
N$11
  Bottom 0.254: U$1.3 151.11,11.13 140.13,11.13 132.83,3.82 70.72,3.82 59.34,15.2 23.02,15.2 17.78,20.44 17.78,27.48 15.25,30.01 R4.2
PWM1
  Bottom 0.254: J2.1 48.72,8.33 BRD1.P1.33
PWM2
  Top 0.254: J4.1 50.05,39.75 47.75,39.75 BRD1.P2.32
PWM3
  Top 0.152: BRD1.P1.31 50.98,5.43 55.81,5.43 59.48,1.76 162.44,1.76 J6.1
PWM4
  Top 0.152: BRD1.P2.34 49.94,36.95 75.44,36.95 82.81,44.32 139.96,44.32 147.58,36.7 156.81,36.7 J8.1
SPI1.CLK  (via drill 0.6)
  Top 0.152: IC1.4 43.5,29.9 44.71,31.11 44.71,34.57 BRD1.P2.29 | U1.23 80.09,21.21 79.23,20.35 77.57,20.35 75.82,22.09 75.82,23.36 v74.55,24.63 | v89.54,27.43 89.73,27.62 J1.4
  Bottom 0.152: BRD1.P2.29 43.64,34.23 54.88,23 67.2,23 68.84,24.63 v74.55,24.63 77.47,27.55 89.54,27.55 v89.54,27.43
SPI1.CS0
  Top 0.152: BRD1.P2.30 43.64,38.05 42.66,37.06 42.67,37.05 42.67,31.74 42.8,31.62 42.89,31.62 43.4,31.1 IC1.2
SPI1.CS1
  Top 0.152: BRD1.P2.31 48.09,33.73 56.34,33.73 69.25,20.82 72.01,20.82 73.66,22.47 73.66,25.39 73.79,25.52 74.8,25.52 76.46,23.87 76.46,22.35 77.98,20.82 78.92,20.82 79.76,21.66 79.76,21.82 79.69,21.89 U1.22
SPI1.CS2  (via drill 0.6)
  Top 0.152: J1.5 88.32,27.09 88.63,27.09 88.77,27.22 88.77,28.05 90.18,29.46 92.2,29.46 92.97,28.7 v92.97,27.17 | v65.03,13.2 62.06,10.23 BRD1.P1.35
  Bottom 0.152: v92.97,27.17 92.97,21.46 91.06,19.55 84.71,19.55 81.54,16.38 68.2,16.38 v65.03,13.2
SPI1.MISO  (via drill 0.6)
  Top 0.152: 79.6,27.62 J1.3 | IC1.5 41.47,29.9 40.85,30.52 40.85,35.38 BRD1.P2.27 | v72.01,23.23 72.01,26.92 73.28,28.19 79.04,28.19 79.6,27.62 | U1.9 79.69,27.54 79.6,27.62
  Bottom 0.152: BRD1.P2.27 41.1,34.58 53.46,22.22 70.99,22.22 v72.01,23.23
SPI1.MOSI  (via drill 0.6)
  Top 0.152: BRD1.P2.25 39.88,36.95 41.91,36.95 42.37,36.49 42.37,31.62 42.55,31.44 42.55,31.31 43.3,30.55 IC1.3 | U1.24 80.49,20.93 79.48,19.92 75.46,19.92 v74.42,20.95 | v89.54,24.76 89.54,25.52 90.64,26.62 J1.6
  Bottom 0.152: BRD1.P2.25 38.56,35.31 52.54,21.33 74.04,21.33 v74.42,20.95 85.73,20.95 v89.54,24.76
UART2.RXD
  Top 0.254: J_GPS.2 15.7,8.3 14.48,9.52 14.48,13.46 15.12,14.09 16.92,14.09 BRD1.P1.10
UART2.TXD
  Top 0.254: J_GPS.3 16.7,11.78 BRD1.P1.8
UART4.RXD
  Bottom 0.254: R4.1 15.25,35.18 BRD1.P2.7
UART4.TXD
  Bottom 0.254: R3.1 13.27,35.52 BRD1.P2.5
VL53.GPIO1
  Bottom 0.152: U3.7 25.52,27.27 25.52,28 25.65,28.13 26.34,28.13 26.45,28.02 28.2,28.02 R8.1
(copper drawn outside any net)
  shapes: Top area x3